# Altium project AMC_FMC_Carrier v4.PrjPcb (part 14 of 17)

## Sheet 8V54816A_SUPPLY.SchDoc: AMC FMC Carrier v4
size 420 x 297 mm; CompanyName: WUT; Organization: WUT ISE; Address1: Warsaw University of Technology; Address2: Nowowiejska 15/19 00-665 Warsaw; Address3: t.przywozki@gmail.com; Revision: 1; SheetNumber: 24; SheetTotal: 29; Project: AMC FMC Carrier v4.0.2; ModifiedBy: F. Świtakowski; CheckedDate: -; Title2: 8V54816A Supply; DivGrp: ISE; Designer: T. Przywozki; ModifiedDate: -; ProjectName: ADC/DAC MEZZANINE
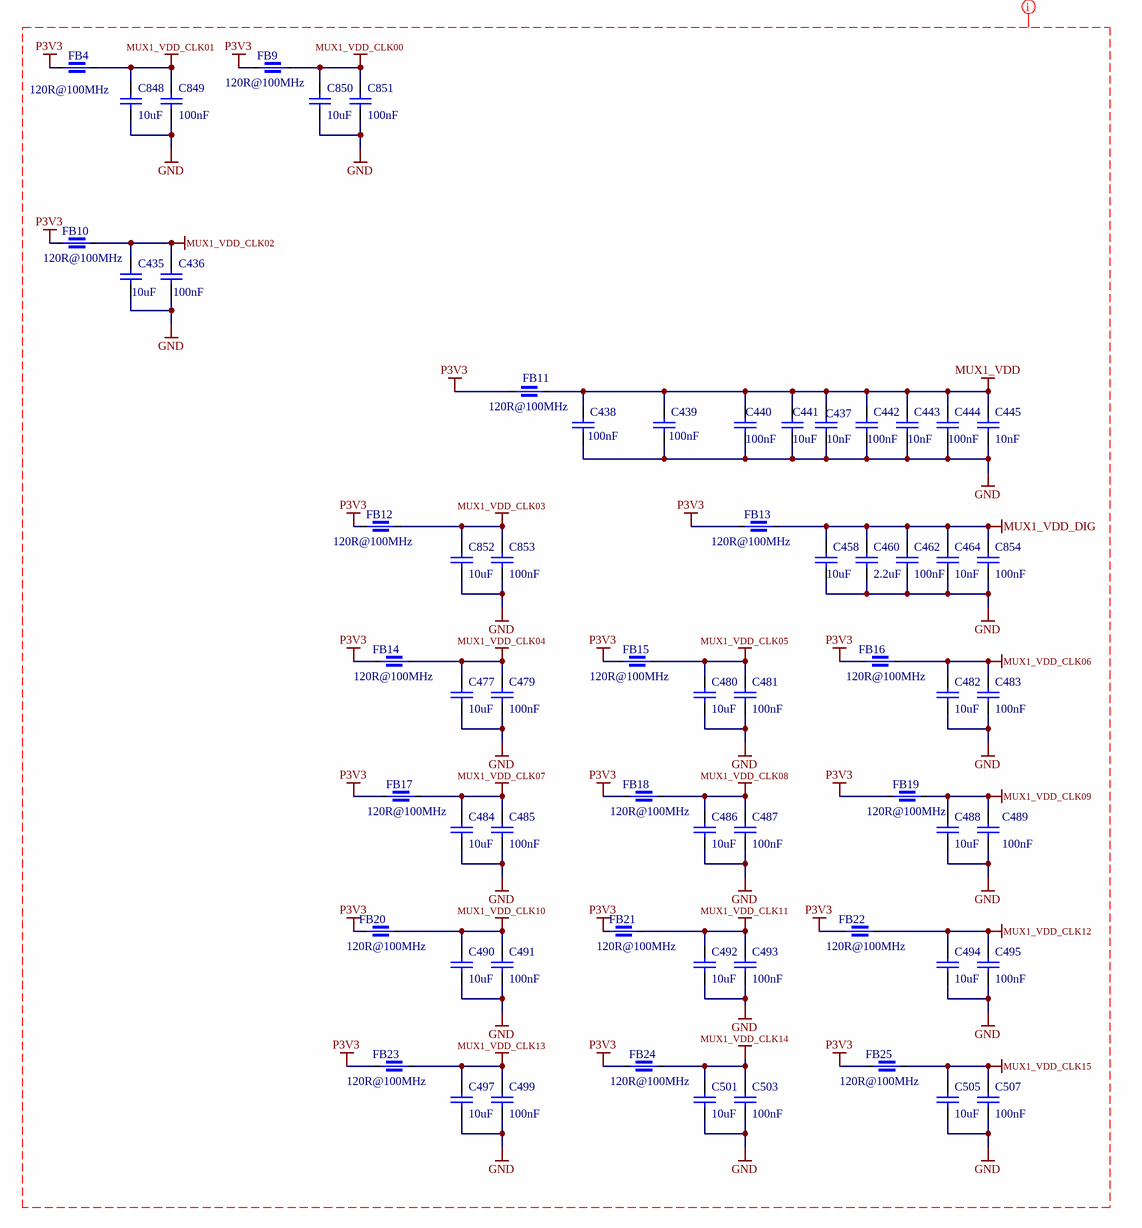
[diagram p25: 8V54816A_SUPPLY.SchDoc]

### Parts
C435  10uF  [CAPC1608X87N]
C436  100nF  [CAPC0603X33N]
C437  10nF  [CAPC0603X33N]
C438  100nF  [CAPC0603X33N]
C439  100nF  [CAPC0603X33N]
C440  100nF  [CAPC0603X33N]
C441  10uF  [CAPC1608X87N]
C442  100nF  [CAPC0603X33N]
C443  10nF  [CAPC0603X33N]
C444  100nF  [CAPC0603X33N]
C445  10nF  [CAPC0603X33N]
C458  10uF  [CAPC1608X87N]
C460  2.2uF  [CAPC1005X55N]
C462  100nF  [CAPC0603X33N]
C464  10nF  [CAPC0603X33N]
C477  10uF  [CAPC1608X87N]
C479  100nF  [CAPC0603X33N]
C480  10uF  [CAPC1608X87N]
C481  100nF  [CAPC0603X33N]
C482  10uF  [CAPC1608X87N]
C483  100nF  [CAPC0603X33N]
C484  10uF  [CAPC1608X87N]
C485  100nF  [CAPC0603X33N]
C486  10uF  [CAPC1608X87N]
C487  100nF  [CAPC0603X33N]
C488  10uF  [CAPC1608X87N]
C489  100nF  [CAPC0603X33N]
C490  10uF  [CAPC1608X87N]
C491  100nF  [CAPC0603X33N]
C492  10uF  [CAPC1608X87N]
C493  100nF  [CAPC0603X33N]
C494  10uF  [CAPC1608X87N]
C495  100nF  [CAPC0603X33N]
C497  10uF  [CAPC1608X87N]
C499  100nF  [CAPC0603X33N]
C501  10uF  [CAPC1608X87N]
C503  100nF  [CAPC0603X33N]
C505  10uF  [CAPC1608X87N]
C507  100nF  [CAPC0603X33N]
C848  10uF  [CAPC1608X87N]
C849  100nF  [CAPC0603X33N]
C850  10uF  [CAPC1608X87N]
C851  100nF  [CAPC0603X33N]
C852  10uF  [CAPC1608X87N]
C853  100nF  [CAPC0603X33N]
C854  100nF  [CAPC0603X33N]
FB4  120R@100MHz  [INDC1005X55N]
FB9  120R@100MHz  [INDC1005X55N]
FB10  120R@100MHz  [INDC1005X55N]
FB11  120R@100MHz  [INDC1005X55N]
FB12  120R@100MHz  [INDC1005X55N]
FB13  120R@100MHz  [INDC1005X55N]
FB14  120R@100MHz  [INDC1005X55N]
FB15  120R@100MHz  [INDC1005X55N]
FB16  120R@100MHz  [INDC1005X55N]
FB17  120R@100MHz  [INDC1005X55N]
FB18  120R@100MHz  [INDC1005X55N]
FB19  120R@100MHz  [INDC1005X55N]
FB20  120R@100MHz  [INDC1005X55N]
FB21  120R@100MHz  [INDC1005X55N]
FB22  120R@100MHz  [INDC1005X55N]
FB23  120R@100MHz  [INDC1005X55N]
FB24  120R@100MHz  [INDC1005X55N]
FB25  120R@100MHz  [INDC1005X55N]

### Nets
GND: C435.1 C436.1 C437.1 C438.1 C439.1 C440.1 C441.1 C442.1 C443.1 C444.1 C445.1 C458.1 C460.1 C462.1 C464.1 C477.1 C479.1 C480.1 C481.1 C482.1 C483.1 C484.1 C485.1 C486.1 C487.1 C488.1 C489.1 C490.1 C491.1 C492.1 C493.1 C494.1 C495.1 C497.1 C499.1 C501.1 C503.1 C505.1 C507.1 C848.1 C849.1 C850.1 C851.1 C852.1 C853.1 C854.1
MUX1_VDD: C437.2 C438.2 C439.2 C440.2 C441.2 C442.2 C443.2 C444.2 C445.2 FB11.1
MUX1_VDD_CLK00: C850.2 C851.2 FB9.1
MUX1_VDD_CLK01: C848.2 C849.2 FB4.1
MUX1_VDD_CLK02: C435.2 C436.2 FB10.1
MUX1_VDD_CLK03: C852.2 C853.2 FB12.1
MUX1_VDD_CLK04: C477.2 C479.2 FB14.1
MUX1_VDD_CLK05: C480.2 C481.2 FB15.1
MUX1_VDD_CLK06: C482.2 C483.2 FB16.1
MUX1_VDD_CLK07: C484.2 C485.2 FB17.1
MUX1_VDD_CLK08: C486.2 C487.2 FB18.1
MUX1_VDD_CLK09: C488.2 C489.2 FB19.1
MUX1_VDD_CLK10: C490.2 C491.2 FB20.1
MUX1_VDD_CLK11: C492.2 C493.2 FB21.1
MUX1_VDD_CLK12: C494.2 C495.2 FB22.1
MUX1_VDD_CLK13: C497.2 C499.2 FB23.1
MUX1_VDD_CLK14: C501.2 C503.2 FB24.1
MUX1_VDD_CLK15: C505.2 C507.2 FB25.1
MUX1_VDD_DIG: C458.2 C460.2 C462.2 C464.2 C854.2 FB13.1
P3V3: FB4.2 FB9.2 FB10.2 FB11.2 FB12.2 FB13.2 FB14.2 FB15.2 FB16.2 FB17.2 FB18.2 FB19.2 FB20.2 FB21.2 FB22.2 FB23.2 FB24.2 FB25.2

### Layout directives
net class POWER: GND, MUX1_VDD, MUX1_VDD_CLK00, MUX1_VDD_CLK01, MUX1_VDD_CLK02, MUX1_VDD_CLK03, MUX1_VDD_CLK04, MUX1_VDD_CLK05, MUX1_VDD_CLK06, MUX1_VDD_CLK07, MUX1_VDD_CLK08, MUX1_VDD_CLK09, MUX1_VDD_CLK10, MUX1_VDD_CLK11, MUX1_VDD_CLK12, MUX1_VDD_CLK13, MUX1_VDD_CLK14, MUX1_VDD_CLK15, MUX1_VDD_DIG, P3V3

### Notes on the sheet
- Project/Equipment
- Document
- Designer
- Drawn by
- Check.by
- Copyright CNPEM 2013, WUT ISE 2020
  This documentation describes Open Hardware and is licensed under CERN OHL v.1.1. You may redistribute and modify this documentaction under the terms of the CERN OHL v1.1.
  (http://ohwr.org/CERNOHL). This documentation is dristributed WITHOUT ANY EXPRESS OR IMPLIED WARRANTY, INCLUDING OF MERCHANTABLITY, SATISFACTORY QUALITY AND FITNESS FOR A PARTICULAR PURPOSE. Please see the CERN OHL v.1.1 for applicable conditions
- File
- Last Mod.
- Print Date
- Sheet
- Size
- A3
- of
- Rev
- Contact:

### Library data of the parts
C435 C441 C458 C477 C480 C482 C484 C486 C488 C490 C492 C494 C497 C501 C505 C848 C850 C852 = CC0603_10uF_6.3V_20%_X5R: Non-polarised capacitor; Manufacturer: GENERIC; Part Description: SMD Multilayer Chip Ceramic Capacitor; Manufacturer1 Part Number: C0603C106M9PAC; Tolerance: ±20%; Voltage: 6.3V; TC: X5R; Manufacturer Part Number: CC0603_10uF_6.3V_20%_X5R; Part Number: CC0603_10UF_6.3V_20%_X5R; Value: 10uF; Component Kind: Standard; Component Type: Standard; Pin Count: 2; Status: Preferred; Case: 0603; Mounted: Yes; Socket: No; SMD: Yes; Sense: No; Manufacturer1 Example: KEMET; Manufacturer1 ComponentHeight: 0.95mm; HelpURL: \\cern.ch\dfs\Applications\Altium\Datasheets\CC0603_X5R_KEMET.pdf; Author: CERN DEM JLC; CreateDate: 03/12/2007; LatestRevisionDate: 03/12/2007
C436 C438-C440 C442 C444 C462 C479 C481 C483 C485 C487 C489 C491 C493 C495 C499 C503 C507 C849 C851 C853 C854 = CC0201_100NF_6.3V_10%_X5R: as C418 on sheet Oscillators; Manufacturer Part Number: CC0201_100NF_6.3V_10%_X5R; Part Number: CC0201_100NF_6.3V_10%_X5R; Value: 100nF; Component Kind: Standard; Component Type: Standard; Pin Count: 2; Status: Not Recommended; Case: 0201; Mounted: Yes; Socket: No; SMD: Yes; Sense: No; Manufacturer1 Example: AVX; Manufacturer1 ComponentHeight: 0.33mm; HelpURL: \\cern.ch\dfs\Applications\Altium\Datasheets\CC0201_X5R_AVX.pdf; Author: CERN DEM JLC; CreateDate: 03/12/2007; LatestRevisionDate: 03/12/2007
C437 C443 C445 C464 = CC0201_10NF_10V_10%_X5R: Non-polarised capacitor; Manufacturer: GENERIC; Manufacturer1 Part Number: 0201ZD103KAT2A; Part Description: SMD Multilayer Chip Ceramic Capacitor; TC: X5R; Tolerance: ±10%; Voltage: 10V; Author: CERN DEM JLC; Case: 0201; Component Kind: Standard; Component Type: Standard; CreateDate: 03/12/2007; HelpURL: \\cern.ch\dfs\Applications\Altium\Datasheets\CC0201_X5R_AVX.pdf; LatestRevisionDate: 03/12/2007; Manufacturer Part Number: CC0201_10NF_10V_10%_X5R; Manufacturer1 ComponentHeight: 0.33mm; Manufacturer1 Example: AVX; Mounted: Yes; Part Number: CC0201_10NF_10V_10%_X5R; Pin Count: 2; SMD: Yes; Socket: No; Status: Not Recommended; Value: 10nF; Sense: No
C460 = CC0402_2.2UF_6.3V_10%_X5R: Non-polarised capacitor; Manufacturer: GENERIC; Part Description: SMD Multilayer Chip Ceramic Capacitor; Manufacturer1 Part Number: C1005X5R0J225K050BC; Tolerance: ±10%; Voltage: 6.3V; TC: X5R; Manufacturer Part Number: CC0402_2.2UF_6.3V_10%_X5R; Part Number: CC0402_2.2UF_6.3V_10%_X5R; Value: 2.2uF; Component Kind: Standard; Component Type: Standard; Pin Count: 2; Status: Preferred; Case: 0402; Mounted: Yes; Socket: No; SMD: Yes; Sense: No; Manufacturer1 Example: TDK; Manufacturer1 ComponentHeight: 0.55mm; HelpURL: \\cern.ch\dfs\Applications\Altium\Datasheets\CC0402_X5R_TDK_C.pdf; Author: CERN DEM JMW; CreateDate: 22/09/2015; LatestRevisionDate: 22/09/2015
FB4 FB9-FB25 = IND0402_MURATA_BLM15PX121SN1D: Manufacturer: MURATA; Part Description: SMD EMIFIL Chip Ferrite Bead; Power: 2A; Resistance: 0.055R; Tolerance: ±25%; Author: CERN DEM JMW; Case: 0402; Component Kind: Standard; Component Type: Standard; ComponentHeight: 0.55mm; CreateDate: 19/02/2014; HelpURL: \\cern.ch\dfs\Applications\Altium\Datasheets\IND0402_MURATA_BLM15PX.pdf; LatestRevisionDate: 25/10/2018; Manufacturer Part Number: BLM15PX121SN1D; Mounted: Yes; Part Number: IND0402_MURATA_BLM15PX121SN1D; Pin Count: 2; SMD: Yes; Socket: No; Status: None; Value: 120R@100MHz; Sense: No

## Sheet USB_SERIAL_QUAD.SchDoc: AMC FMC Carrier v4.0.5
size 420 x 297 mm; CmpIndex: 15; Drawing Project: AMC FMC Carrier Board; SymIndex: 2141; CompanyName: WUT; Organization: WUT ISE; Address1: Warsaw University of Technology; Address2: Nowowiejska 15/19 00-665 Warsaw; Address3: t.przywozki@gmail.com; Revision: 1; SheetNumber: 28; SheetTotal: 29; Project: AMC FMC Carrier v4.0.5; ModifiedBy: F. Świtakowski; CheckedDate: -; Title2: Quad USB - serial; DivGrp: ISE; Designer: T. Przywozki; ModifiedDate: -; ProjectName: ADC/DAC MEZZANINE
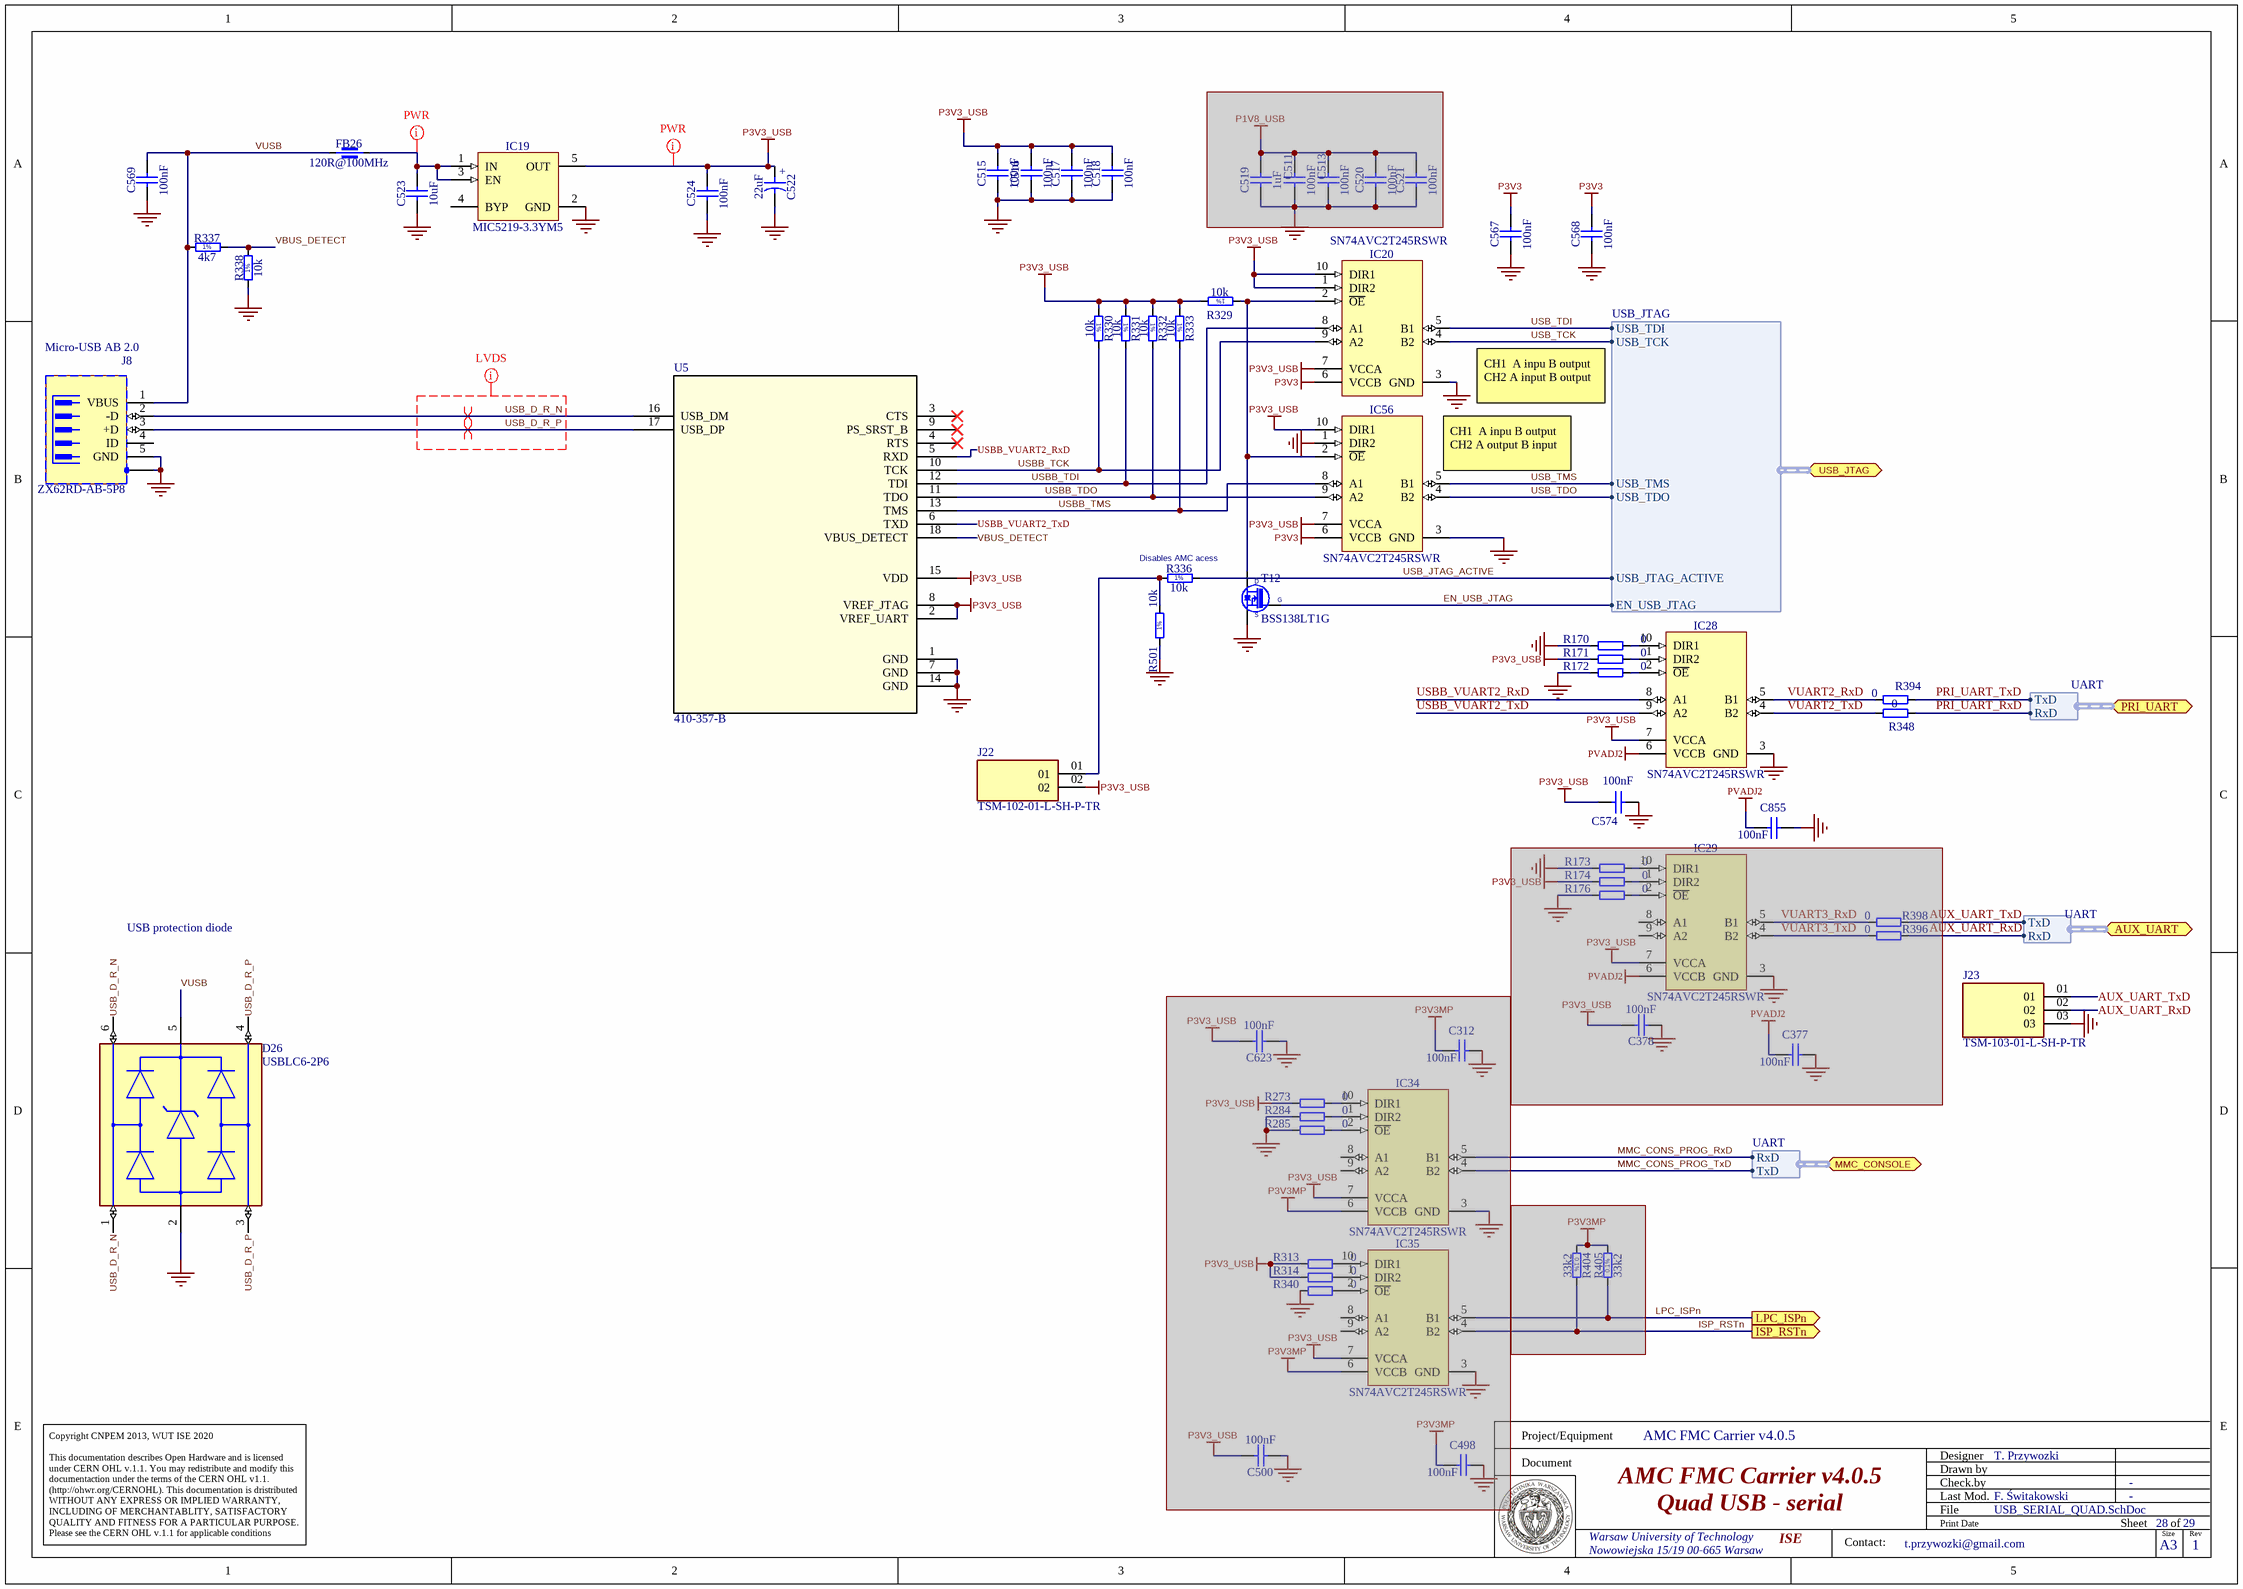
[diagram p26: USB_SERIAL_QUAD.SchDoc]

### Parts
C312  100nF  [CAPC0603X33N]  (masked out: inside a compile mask, not in the netlist)
C377  100nF  [CAPC0603X33N]  (masked out: inside a compile mask, not in the netlist)
C378  100nF  [CAPC0603X33N]  (masked out: inside a compile mask, not in the netlist)
C498  100nF  [CAPC0603X33N]  (masked out: inside a compile mask, not in the netlist)
C500  100nF  [CAPC0603X33N]  (masked out: inside a compile mask, not in the netlist)
C511  100nF  [CAPC0603X33N]  (masked out: inside a compile mask, not in the netlist)
C513  100nF  [CAPC0603X33N]  (masked out: inside a compile mask, not in the netlist)
C515  100nF  [CAPC0603X33N]
C516  100nF  [CAPC0603X33N]
C517  100nF  [CAPC0603X33N]
C518  100nF  [CAPC0603X33N]
C519  1uF  [CAPC1005X55N]  (masked out: inside a compile mask, not in the netlist)
C520  100nF  [CAPC0603X33N]  (masked out: inside a compile mask, not in the netlist)
C521  100nF  [CAPC0603X33N]  (masked out: inside a compile mask, not in the netlist)
C522  22uF  [CAPMP3216X180N]
C523  10uF  [CAPC1608X87N]
C524  100nF  [CAPC0603X33N]
C567  100nF  [CAPC0603X33N]
C568  100nF  [CAPC0603X33N]
C569  100nF  [CAPC0603X33N]
C574  100nF  [CAPC0603X33N]
C623  100nF  [CAPC0603X33N]  (masked out: inside a compile mask, not in the netlist)
C855  100nF  [CAPC0603X33N]
D26  USBLC6-2P6  [FP-SOT-666-MFG]
FB26  120R@100MHz  [INDC1608X65N]
IC19  MIC5219-3.3YM5  [SOT95P280X145-5N]
IC20  SN74AVC2T245RSWR  [QFN40P140X180X55-10N]
IC28  SN74AVC2T245RSWR  [QFN40P140X180X55-10N]
IC29  SN74AVC2T245RSWR  [QFN40P140X180X55-10N]  (masked out: inside a compile mask, not in the netlist)
IC34  SN74AVC2T245RSWR  [QFN40P140X180X55-10N]  (masked out: inside a compile mask, not in the netlist)
IC35  SN74AVC2T245RSWR  [QFN40P140X180X55-10N]  (masked out: inside a compile mask, not in the netlist)
IC56  SN74AVC2T245RSWR  [QFN40P140X180X55-10N]
J8  Micro-USB AB 2.0  Manufacturer Part Number: ZX62RD-AB-5P8  [HIROSE_ZX62RD-AB-5P8]
J22  TSM-102-01-L-SH-P-TR  [SAMTEC_TSM-102-01-L-SH-P-TR]
J23  TSM-103-01-L-SH-P-TR  [SAMTEC_TSM-103-01-L-SH-P-TR]
R170  0  [RESC0603X28N]
R171  0  [RESC0603X28N]
R172  0  [RESC0603X28N]
R173  0  [RESC0603X28N]  (masked out: inside a compile mask, not in the netlist)
R174  0  [RESC0603X28N]  (masked out: inside a compile mask, not in the netlist)
R176  0  [RESC0603X28N]  (masked out: inside a compile mask, not in the netlist)
R273  0  [RESC0603X28N]  (masked out: inside a compile mask, not in the netlist)
R284  0  [RESC0603X28N]  (masked out: inside a compile mask, not in the netlist)
R285  0  [RESC0603X28N]  (masked out: inside a compile mask, not in the netlist)
R313  0  [RESC0603X28N]  (masked out: inside a compile mask, not in the netlist)
R314  0  [RESC0603X28N]  (masked out: inside a compile mask, not in the netlist)
R329  10k  [RESC1005X40N]
R330  10k  [RESC1005X40N]
R331  10k  [RESC1005X40N]
R332  10k  [RESC1005X40N]
R333  10k  [RESC1005X40N]
R336  10k  [RESC1005X40N]
R337  4k7  [RESC1005X40N]
R338  10k  [RESC1005X40N]
R340  0  [RESC0603X28N]  (masked out: inside a compile mask, not in the netlist)
R348  0  [RESC1005X40N]
R394  0  [RESC1005X40N]
R396  0  [RESC1005X40N]  (masked out: inside a compile mask, not in the netlist)
R398  0  [RESC1005X40N]  (masked out: inside a compile mask, not in the netlist)
R404  33k2  [RESC1608X55N]  (masked out: inside a compile mask, not in the netlist)
R405  33k2  [RESC1608X55N]  (masked out: inside a compile mask, not in the netlist)
R501  10k  [RESC1005X40N]
T12  BSS138LT1G  [SOT95P240X110-3N]
U5  410-357-B  [QFN18_410-357-B_DGT]

### Ports
AUX_UART (bidir, harness UART), ISP_RSTn (out), LPC_ISPn (out), MMC_CONSOLE (bidir, harness UART), PRI_UART (bidir, harness UART), USB_JTAG (bidir, harness USB_JTAG)

### Harnesses
UART: RxD, TxD
USB_JTAG: USB_TDI, USB_TCK, USB_TMS, USB_TDO, USB_JTAG_ACTIVE, EN_USB_JTAG

### Nets
GND: C515.1 C516.1 C517.1 C518.1 C522.2 C523.1 C524.1 C567.1 C568.1 C569.1 C574.1 C855.1 D26.2(GND) IC19.2(GND) IC20.3(GND) IC28.3(GND) IC56.1(DIR2) IC56.3(GND) J8.5(GND) J8.6(SH) J23.03 R170.1 R172.1 R338.1 R501.1 T12.2(S) U5.1(GND) U5.7(GND) U5.14(GND)
P3V3: C567.2 C568.2 IC20.6(VCCB) IC56.6(VCCB)
P3V3_USB: C515.2 C516.2 C517.2 C518.2 C522.1 C524.2 C574.2 IC19.5(OUT) IC20.1(DIR2) IC20.7(VCCA) IC20.10(DIR1) IC28.7(VCCA) IC56.7(VCCA) IC56.10(DIR1) J22.02 R171.1 R329.2 R330.1 R331.1 R332.1 R333.1 U5.2(VREF_UART) U5.8(VREF_JTAG) U5.15(VDD)
PVADJ2: C855.2 IC28.6(VCCB)
AUX_UART_RxD: J23.02
AUX_UART_TxD: J23.01
EN_USB_JTAG: T12.1(G) ; port USB_JTAG.EN_USB_JTAG
PRI_UART_RxD: R348.1 ; port PRI_UART.RxD  [project net PRI_UART_Rx]
PRI_UART_TxD: R394.1 ; port PRI_UART.TxD  [project net PRI_UART_Tx]
USB_D_R_N: D26.1(I/O1) D26.6(I/O1) J8.2(-D) U5.16(USB_DM)
USB_D_R_P: D26.3(I/O2) D26.4(I/O2) J8.3(+D) U5.17(USB_DP)
USB_JTAG_ACTIVE: R336.2 ; port USB_JTAG.USB_JTAG_ACTIVE
USB_TCK: IC20.4(B2) ; port USB_JTAG.USB_TCK
USB_TDI: IC20.5(B1) ; port USB_JTAG.USB_TDI
USB_TDO: IC56.4(B2) ; port USB_JTAG.USB_TDO
USB_TMS: IC56.5(B1) ; port USB_JTAG.USB_TMS
USBB_TCK: IC20.9(A2) R330.2 U5.10(TCK)
USBB_TDI: IC20.8(A1) R331.2 U5.12(TDI)
USBB_TDO: IC56.9(A2) R332.2 U5.11(TDO)
USBB_TMS: IC56.8(A1) R333.2 U5.13(TMS)
USBB_VUART2_RxD: IC28.8(A1) U5.5(RXD)
USBB_VUART2_TxD: IC28.9(A2)
VBUS_DETECT: R337.2 R338.2 U5.18(VBUS_DETECT)
VUART2_RxD: IC28.5(B1) R394.2
VUART2_TxD: IC28.4(B2) R348.2
VUSB: C569.2 D26.5(VBUS) FB26.1 J8.1(VBUS) R337.1
NetC523_2: C523.2 FB26.2 IC19.1(IN) IC19.3(EN)
NetIC20_2: IC20.2(~{OE}) IC56.2(~{OE}) R329.1 T12.3(D)
NetIC28_1: IC28.1(DIR2) R171.2
NetIC28_2: IC28.2(~{OE}) R172.2
NetIC28_10: IC28.10(DIR1) R170.2
NetJ22_01: J22.01 R336.1 R501.2

Not connected (* = marked no-connect by the designer): IC19 4(BYP); J8 4(ID); U5 3(CTS)* 4(RTS)* 6(TXD) 9(PS_SRST_B)*

### Layout directives
net class PWR: NetC523_2, P3V3_USB
differential pair: USB_D_R_N, USB_D_R_P
net class LVDS: USB_D_R_N, USB_D_R_P

### Notes on the sheet
- CH1  A inpu B output
  CH2 A input B output
- (near IC56) CH1  A inpu B output
  CH2 A output B input
- (near R336) Disables AMC acess
- USB protection diode
- Labels drawn without touching a wire or pin: USBB_VUART2_TxD
- Project/Equipment
- Document
- Designer
- Drawn by
- Check.by
- Copyright CNPEM 2013, WUT ISE 2020
  This documentation describes Open Hardware and is licensed under CERN OHL v.1.1. You may redistribute and modify this documentaction under the terms of the CERN OHL v1.1.
  (http://ohwr.org/CERNOHL). This documentation is dristributed WITHOUT ANY EXPRESS OR IMPLIED WARRANTY, INCLUDING OF MERCHANTABLITY, SATISFACTORY QUALITY AND FITNESS FOR A PARTICULAR PURPOSE. Please see the CERN OHL v.1.1 for applicable conditions
- File
- Last Mod.
- Print Date
- Sheet
- Size
- A3
- of
- Rev
- Contact:
- (in symbol CTE3216-18_22UF_6.3V_10%_LESR0900) +
- (in symbol R0402_2K2_1%_0.0625W_100PPM) 1%
- (in symbol R0402_10K_1%_0.0625W_100PPM) 1%
- (in symbol R0603_33K2_0.1%_0.063W_10PPM) 0.1%

### Library data of the parts
C312 C377 C378 C498 C500 C511 C513 C515-C518 C520 C521 C524 C567-C569 C574 C623 C855 = CC0201_100NF_6.3V_10%_X5R: as C418 on sheet Oscillators; Manufacturer Part Number: CC0201_100NF_6.3V_10%_X5R; Part Number: CC0201_100NF_6.3V_10%_X5R; Value: 100nF; Component Kind: Standard; Component Type: Standard; Pin Count: 2; Status: Not Recommended; Case: 0201; Mounted: Yes; Socket: No; SMD: Yes; Sense: No; Manufacturer1 Example: AVX; Manufacturer1 ComponentHeight: 0.33mm; HelpURL: \\cern.ch\dfs\Applications\Altium\Datasheets\CC0201_X5R_AVX.pdf; Author: CERN DEM JLC; CreateDate: 03.12.2007; LatestRevisionDate: 03.12.2007
C519 = CC0402_1UF_16V_10%_X5R: Non-polarised capacitor; Manufacturer: GENERIC; Part Description: SMD Multilayer Chip Ceramic Capacitor; Manufacturer1 Part Number: C1005X5R1C105KT; Tolerance: ±10%; Voltage: 16V; TC: X5R; Manufacturer Part Number: CC0402_1UF_16V_10%_X5R; Part Number: CC0402_1UF_16V_10%_X5R; Value: 1uF; Component Kind: Standard; Component Type: Standard; Pin Count: 2; Status: Preferred; Case: 0402; Mounted: Yes; Socket: No; SMD: Yes; Sense: No; Manufacturer1 Example: TDK; Manufacturer1 ComponentHeight: 0.55mm; HelpURL: \\cern.ch\dfs\Applications\Altium\Datasheets\CC0402_X5R_TDK_C.pdf; Author: CERN DEM JLC; CreateDate: 25.10.2012; LatestRevisionDate: 25.10.2012
C522 = CTE3216-18_22UF_6.3V_10%_LESR0900: Polarised capacitor; Manufacturer: GENERIC; Part Description: Low ESR 0R9 Solid Tantalum Chip Capacitor; Manufacturer1 Part Number: TPSA226K006R0900; Tolerance: ±10%; Voltage: 6.3V; Manufacturer Part Number: CTE3216-18_22UF_6.3V_10%_LESR0900; Part Number: CTE3216-18_22UF_6.3V_10%_LESR0900; Value: 22uF; Component Kind: Standard; Component Type: Standard; Pin Count: 2; Status: Preferred; Case: A; Mounted: Yes; Socket: No; SMD: Yes; Sense: No; Manufacturer1 Example: AVX; Manufacturer1 ComponentHeight: 1.8mm; HelpURL: \\cern.ch\dfs\Applications\Altium\Datasheets\CTE-LESR_AVX_TPS.pdf; Author: CERN DEM JLC; CreateDate: 05.05.2008; LatestRevisionDate: 20.01.2009
C523 = CC0603_10UF_6.3V_20%_X5R: Non-polarised capacitor; Manufacturer: GENERIC; Part Description: SMD Multilayer Chip Ceramic Capacitor; Manufacturer1 Part Number: C0603C106M9PAC; Tolerance: ±20%; Voltage: 6.3V; TC: X5R; Manufacturer Part Number: CC0603_10uF_6.3V_20%_X5R; Part Number: CC0603_10UF_6.3V_20%_X5R; Value: 10uF; Component Kind: Standard; Component Type: Standard; Pin Count: 2; Status: Preferred; Case: 0603; Mounted: Yes; Socket: No; SMD: Yes; Sense: No; Manufacturer1 Example: KEMET; Manufacturer1 ComponentHeight: 0.95mm; HelpURL: \\cern.ch\dfs\Applications\Altium\Datasheets\CC0603_X5R_KEMET.pdf; Author: CERN DEM JLC; CreateDate: 03.12.2007; LatestRevisionDate: 03.12.2007
D26 = CMP-12225-000058-1: TVS DIODE 5.25V 17V SOT666; Min Breakdown Voltage: 6V; Power Line Protection: Yes; Element Configuration: Dual; Test Current: 1mA; Working Voltage: 5V; Number of Channels: 2; Max Reverse Leakage Current: 150nA; Direction: Unidirectional; Peak Pulse Current: 5A; Number of Elements: 1; Capacitance: 3.5pF; Max Breakdown Voltage: 6V; Height: 0.6mm; Depth: 1.3mm; Contact Plating: Tin; Reverse Breakdown Voltage: 6V; REACH SVHC: No SVHC; Operating Supply Voltage: 5V; Width: 1.3mm; Max Operating Temperature: 125°C; Reverse Standoff Voltage: 5V; ESD Protection: Yes; Package Quantity: 1; Termination: SMD/SMT; Length: 1.7mm; Leakage Current: 150nA; Number of Bidirectional Channels: 2; Case/Package: SOT-666; Min Operating Temperature: -40°C; Number of Pins: 6; Clamping Voltage: 17V; Breakdown Voltage: 6V; Lead Free: Lead Free; Radiation Hardening: No; Packaging: Tape and Reel; Mount: Surface Mount; Polarity: Unidirectional
FB26 = IND0603_MURATA_BLM18SG121TN1D: Manufacturer: MURATA; Part Description: SMD EMIFIL Suppression Chip Ferrite Bead; Tolerance: ±25%; Power: 3A; Resistance: 0.025R; Manufacturer Part Number: BLM18SG121TN1D; Part Number: IND0603_MURATA_BLM18SG121TN1D; Value: 120R@100MHz; Component Kind: Standard; Component Type: Standard; Pin Count: 2; Status: None; Case: 0603; Mounted: Yes; Socket: No; SMD: Yes; Sense: No; ComponentHeight: 0.65mm; HelpURL: \\cern.ch\dfs\Applications\Altium\Datasheets\IND0603_MURATA_BLM18S.pdf; Author: CERN DEM JLC; CreateDate: 23.07.2014; LatestRevisionDate: 25.10.2018
IC19 = MIC5219-3.3YM5: 500mA Peak Output LDO Regulator; Part Description: 3.3V 500mA Peak Output Low Drop-Out  (LDO) Regulator; Manufacturer: MICROCHIP TECHNOLOGY; PressFit: No; Bonding: No; Part Number: MIC5219-3.3YM5; Component Kind: Standard; Component Type: Standard; Device: MIC5219-3.3YM5; PackageDescription: SOT, 0.95mm pitch; 5 pin, 1.60mm W X 2.90mm L X 1.45mm H body, IPC Medium Density; Manufacturer Part Number: MIC5219-3.3YM5; Pin Count: 5; Case: SOT23-5; Mounted: Yes; Socket: No; SMD: Yes; Sense: No; ComponentHeight: 1.45mm; HelpURL: \\cern.ch\dfs\Applications\Altium\Datasheets\MIC5219-3.3YM5.pdf; Author: CERN DEM WB; CreateDate: 16.04.2019; LatestRevisionDate: 16.04.2019
IC20 IC28 IC29 IC34 IC35 IC56 = SN74AVC2T245RSWR: Dual-Bit Dual-Supply Bus Transceiver With Configurable Voltage Translation and 3-State Outputs; Manufacturer: TEXAS INSTRUMENTS; PressFit: No; Bonding: No; Manufacturer Part Number: SN74AVC2T245RSWR; PackageDescription: QFN, 0.40mm Pitch, Rect.;10 Pin, 1.80mm L X 1.40mm W X 0.55mm H Body, IPC Medium Density; Part Description: Dual-Bit Dual-Supply Bus Transceiver With Configurable Voltage Translation and 3-State Outputs; Part Number: SN74AVC2T245RSWR; Component Kind: Standard; Component Type: Standard; Device: SN74AVC2T245RSWR; Status: Not Recommended; Pin Count: 10; Case: QFN10; Mounted: Yes; Socket: No; SMD: Yes; Sense: No; ComponentHeight: 0.55mm; Author: CERN DEM JLC; HelpURL: \\cern.ch\dfs\Applications\Altium\Datasheets\SN74AVC2T245RSWR.pdf; CreateDate: 07.07.2014; LatestRevisionDate: 30.03.2017
J8 = HIROSE_ZX62RD-AB-5P8: 5 Pin + 1 Shield USB Receptacle; Manufacturer: HIROSE (HRS); Part Description: Micro-USB 2.0 Right Angle, SMD Type AB - Reverse (Top mount), Shell Through Hole; PressFit: No; Part Number: HIROSE_ZX62RD-AB-5P8; Component Kind: Standard; Component Type: Standard; Pin Count: 7; Family: Micro-USB AB 2.0; Mounted: Yes; Socket: No; SMD: Yes; Sense: No; Status: Obsolete; ComponentHeight: 2.35mm; HelpURL: \\cern.ch\dfs\Applications\Altium\Datasheets\HIROSE_ZX62RD-AB-5P8.pdf; ComponentLink1URL: \\cern.ch\dfs\Applications\Altium\Datasheets\HIROSE_ZX62RD-AB-5P8_Package-Drawing.pdf; ComponentLink1Description: Package-Drawing; Author: CERN DEM JLC; CreateDate: 29.10.2014; LatestRevisionDate: 22.06.2017
J22 = TSM-102-01-L-SH-P-TR: MF: Samtec; Availability: Unavailable; MP: TSM-102-01-L-SH-P-TR; Price: None; Package: None; Value: *
J23 = TSM-103-01-L-SH-P-TR: MF: Samtec; Availability: Unavailable; MP: TSM-103-01-L-SH-P-TR; Package: None; Value: *; Price: None
R170-R174 R176 R273 R284 R285 R313 R314 R340 = R0201_0R_JUMPER: as R354-R357 on sheet Clock_management; Part Number: R0201_0R_JUMPER; Component Kind: Standard; Component Type: Standard; Pin Count: 2; Value: 0; Status: Not Recommended; Manufacturer Part Number: R0201_0R_JUMPER; Case: 0201; Mounted: Yes; Sense: No; Socket: No; SMD: Yes; Manufacturer1 Example: VISHAY; Manufacturer1 ComponentHeight: 0.27mm; HelpURL: \\cern.ch\dfs\Applications\Altium\Datasheets\R0201_VISHAY_CRCW e3.pdf; Author: CERN DEM JLC; CreateDate: 19.11.2014; LatestRevisionDate: 08.01.2015
R329-R333 R336 R338 R501 = R0402_10K_1%_0.0625W_100PPM: Resistor - 1%; Manufacturer: GENERIC; Part Description: General Purpose Thick Film Chip Resistor; Manufacturer1 Part Number: 232270671003L; TC: ±100ppm/°C; PressFit: No; Manufacturer Part Number: R0402_10K_1%_0.0625W_100PPM; Part Number: R0402_10K_1%_0.0625W_100PPM; Tolerance: ±1%; Value: 10k; Component Kind: Standard; Component Type: Standard; Pin Count: 2; Status: Not Recommended; Power: 0.0625W; Case: 0402; Mounted: Yes; Sense: No; Socket: No; SMD: Yes; Manufacturer1 Example: YAGEO PHYCOMP; Manufacturer1 ComponentHeight: 0.4mm; HelpURL: \\cern.ch\dfs\Applications\Altium\Datasheets\R0402_Phycomp_RC0402.pdf; Author: CERN DEM JLC; CreateDate: 03.12.2007; LatestRevisionDate: 17.10.2012
R337 = R0402_2K2_1%_0.0625W_100PPM: Resistor - 1%; Manufacturer: GENERIC; Part Description: General Purpose Thick Film Chip Resistor; Manufacturer1 Part Number: 232270672202L; TC: ±100ppm/°C; PressFit: No; Manufacturer Part Number: R0402_2K2_1%_0.0625W_100PPM; Part Number: R0402_2K2_1%_0.0625W_100PPM; Tolerance: ±1%; Value: 4k7; Component Kind: Standard; Component Type: Standard; Pin Count: 2; Status: Not Recommended; Power: 0.0625W; Case: 0402; Mounted: Yes; Sense: No; Socket: No; SMD: Yes; Manufacturer1 Example: YAGEO PHYCOMP; Manufacturer1 ComponentHeight: 0.4mm; HelpURL: \\cern.ch\dfs\Applications\Altium\Datasheets\R0402_Phycomp_RC0402.pdf; Author: CERN DEM JLC; CreateDate: 03.12.2007; LatestRevisionDate: 17.10.2012
R348 R394 R396 R398 = R0402_0R_JUMPER: Resistor; Manufacturer: GENERIC; Part Description: 1A (0.05R Max DC Resistance) Zero Ohm Jumper; Manufacturer1 Part Number: 232270591001L; PressFit: No; Manufacturer Part Number: R0402_0R_JUMPER; Part Number: R0402_0R_JUMPER; Value: 0; Component Kind: Standard; Component Type: Standard; Pin Count: 2; Status: Not Recommended; Case: 0402; Mounted: Yes; Sense: No; Socket: No; SMD: Yes; Manufacturer1 Example: YAGEO PHYCOMP; Manufacturer1 ComponentHeight: 0.4mm; HelpURL: \\cern.ch\dfs\Applications\Altium\Datasheets\R0402_Phycomp_RC0402.pdf; Author: CERN DEM JLC; CreateDate: 03.12.2007; LatestRevisionDate: 17.10.2012
R404 R405 = R0603_33K2_0.1%_0.063W_10PPM: Resistor - 0.1%; Manufacturer: GENERIC; Part Description: Thin Film Chip Resistor; Manufacturer1 Part Number: RN73C1J33K2BTDF; Power: 0.063W; TC: ±10ppm; PressFit: No; Manufacturer Part Number: R0603_33K2_0.1%_0.063W_10PPM; Part Number: R0603_33K2_0.1%_0.063W_10PPM; Tolerance: ±0.1%; Value: 33k2; Component Kind: Standard; Component Type: Standard; Pin Count: 2; Status: Not Recommended; Case: 0603; Mounted: Yes; Sense: No; Socket: No; SMD: Yes; Manufacturer1 Example: TYCO HOLSWORTHY; Manufacturer1 ComponentHeight: 0.5mm; HelpURL: \\cern.ch\dfs\Applications\Altium\Datasheets\R0603_Tyco_RN73.pdf; Author: CERN DEM JLC; CreateDate: 03.12.2007; LatestRevisionDate: 13.03.2008
T12 = BSS138LT1G: N-CHANNEL MOSFET WITH DIODE; Manufacturer: ON SEMICONDUCTOR; Part Description: 50V 200mA N-Channel Enhancement Mode Field-Effect Transistor; PressFit: No; Bonding: No; Manufacturer Part Number: BSS138LT1G; PackageDescription: SOT23 3-Leads, Pitch 0.95mm - Body 1.4x3mm, IPC Medium Density; Part Number: BSS138LT1G; Component Kind: Standard; Component Type: Standard; Device: BSS138LT1G; Pin Count: 3; Case: SOT23-3; Mounted: Yes; Socket: No; SMD: Yes; Sense: No; ComponentHeight: 1.11mm; HelpURL: \\cern.ch\dfs\Applications\Altium\Datasheets\BSS138LT1G.pdf; Author: CERN DEM JLC; CreateDate: 23.03.2009; LatestRevisionDate: 23.03.2009
U5 = 410-357-B: Description; Manufacturer_Name: Digilent; Copyright: Copyright (C) 2026 Ultra Librarian. All rights reserved.; Manufacturer_Part_Number: 410-357-B; RefDes: RefDes; Type: Type; Manufacturer: Digilent; Part Number: 410-357-B

## Sheet I2C_MUX.SchDoc: AMC FMC Carrier v4.0.2
size A4; CmpIndex: 31; Drawing Project: AMC FMC Carrier Board; SymIndex: 2141; CompanyName: WUT; Organization: WUT ISE; Address1: Warsaw University of Technology; Address2: Nowowiejska 15/19 00-665 Warsaw; Address3: t.przywozki@gmail.com; Revision: 1; SheetNumber: 29; SheetTotal: 29; Project: AMC FMC Carrier v4; ModifiedBy: F. Świtakowski; CheckedDate: -; Title2: I2C switches; DivGrp: ISE; Designer: T. Przywozki; ModifiedDate: -; ProjectName: ADC/DAC MEZZANINE
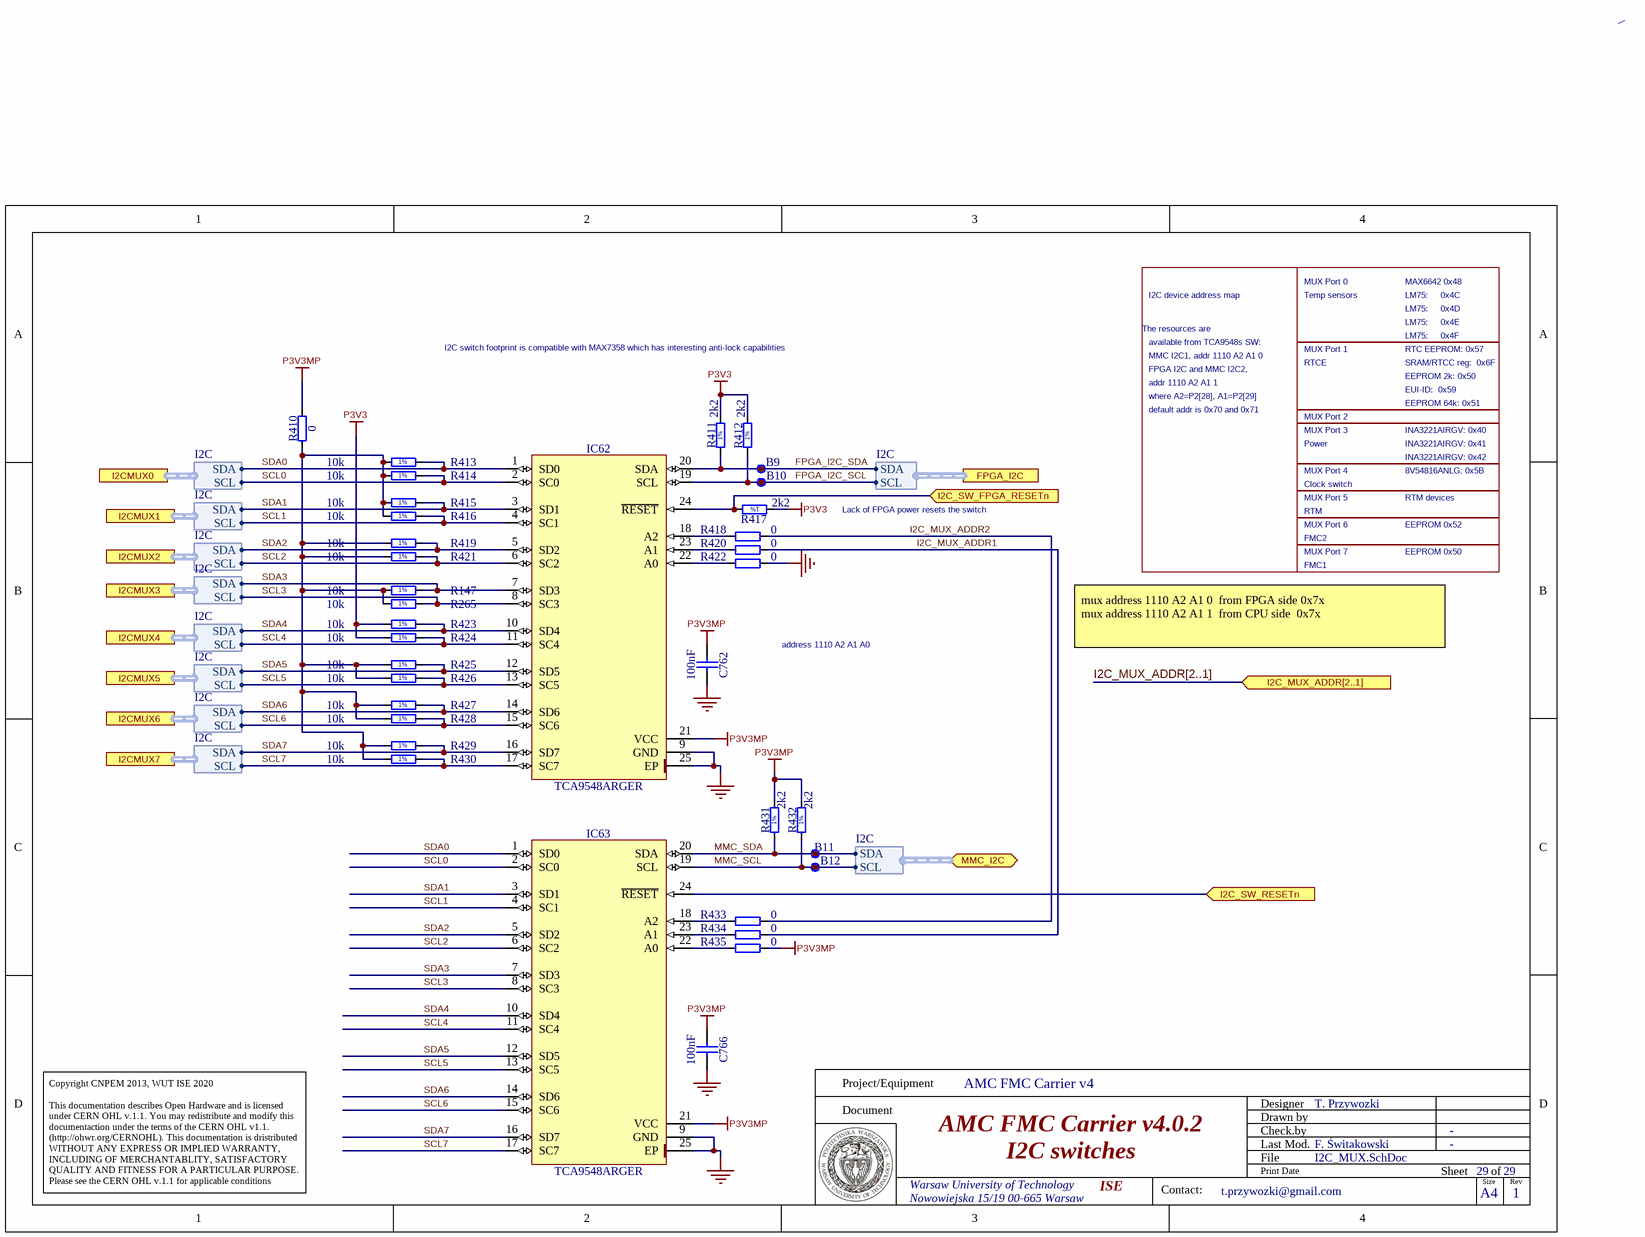
[diagram p27: I2C_MUX.SchDoc]

### Parts
B9  SMD Pad  [C100]  (value not drawn)  (no BOM)
B10  SMD Pad  [C100]  (value not drawn)  (no BOM)
B11  SMD Pad  [C100]  (value not drawn)  (no BOM)
B12  SMD Pad  [C100]  (value not drawn)  (no BOM)
C762  100nF  [CAPC0603X33N]
C766  100nF  [CAPC0603X33N]
IC62  TCA9548ARGER  [QFN50P400X400X100-25N-S220]
IC63  TCA9548ARGER  [QFN50P400X400X100-25N-S220]
R147  10k  [RESC1005X40N]
R265  10k  [RESC1005X40N]
R410  0  [RESC1005X40N]
R411  2k2  [RESC1005X40N]
R412  2k2  [RESC1005X40N]
R413  10k  [RESC1005X40N]
R414  10k  [RESC1005X40N]
R415  10k  [RESC1005X40N]
R416  10k  [RESC1005X40N]
R417  2k2  [RESC1005X40N]
R418  0  [RESC1005X40N]
R419  10k  [RESC1005X40N]
R420  0  [RESC1005X40N]
R421  10k  [RESC1005X40N]
R422  0  [RESC1005X40N]
R423  10k  [RESC1005X40N]
R424  10k  [RESC1005X40N]
R425  10k  [RESC1005X40N]
R426  10k  [RESC1005X40N]
R427  10k  [RESC1005X40N]
R428  10k  [RESC1005X40N]
R429  10k  [RESC1005X40N]
R430  10k  [RESC1005X40N]
R431  2k2  [RESC1005X40N]
R432  2k2  [RESC1005X40N]
R433  0  [RESC1005X40N]
R434  0  [RESC1005X40N]
R435  0  [RESC1005X40N]

### Ports
FPGA_I2C (harness I2C), I2C_MUX_ADDR[2..1] (in), I2C_SW_FPGA_RESETn (in), I2C_SW_RESETn (in), I2CMUX0 (harness I2C), I2CMUX1 (harness I2C), I2CMUX2 (harness I2C), I2CMUX3 (harness I2C), I2CMUX4 (harness I2C), I2CMUX5 (harness I2C), I2CMUX6 (harness I2C), I2CMUX7 (harness I2C), MMC_I2C (bidir, harness I2C)

### Harnesses
I2C: SCL, SDA

### Nets
GND: C762.2 C766.2 IC62.9(GND) IC62.25(EP) IC63.9(GND) IC63.25(EP) R422.1
P3V3: R411.2 R412.2 R417.1 R423.1 R424.1
P3V3MP: C762.1 C766.1 IC62.21(VCC) IC63.21(VCC) R410.1 R431.2 R432.2 R435.1
FPGA_I2C_RST: IC62.24(~{RESET}) R417.2 ; port I2C_SW_FPGA_RESETn
FPGA_I2C_SCL: B10.1 IC62.19(SCL) R412.1 ; port FPGA_I2C.SCL
FPGA_I2C_SDA: B9.1 IC62.20(SDA) R411.1 ; port FPGA_I2C.SDA
I2C_MUX_ADDR1: R420.1 R434.1
I2C_MUX_ADDR2: R418.1 R433.1
I2C_SW_RESETn: IC63.24(~{RESET}) ; port I2C_SW_RESETn
MMC_SCL: B12.1 IC63.19(SCL) R432.1 ; port MMC_I2C.SCL  [project net I2C_CPU.SCL]
MMC_SDA: B11.1 IC63.20(SDA) R431.1 ; port MMC_I2C.SDA  [project net I2C_CPU.SDA]
SCL0: IC62.2(SC0) IC63.2(SC0) R414.2 ; port I2CMUX0.SCL
SCL1: IC62.4(SC1) IC63.4(SC1) R416.2 ; port I2CMUX1.SCL  [project net SCL]
SCL2: IC62.6(SC2) IC63.6(SC2) R421.2 ; port I2CMUX2.SCL
SCL3: IC62.8(SC3) IC63.8(SC3) R265.2 ; port I2CMUX3.SCL  [project net PM_I2C.SCL]
SCL4: IC62.11(SC4) IC63.11(SC4) R424.2 ; port I2CMUX4.SCL  [project net CLK_I2C.SCL]
SCL5: IC62.13(SC5) IC63.13(SC5) R426.2 ; port I2CMUX5.SCL
SCL6: IC62.15(SC6) IC63.15(SC6) R428.2 ; port I2CMUX6.SCL  [project net I2C2.SCL]
SCL7: IC62.17(SC7) IC63.17(SC7) R430.2 ; port I2CMUX7.SCL  [project net I2C1.SCL]
SDA0: IC62.1(SD0) IC63.1(SD0) R413.2 ; port I2CMUX0.SDA
SDA1: IC62.3(SD1) IC63.3(SD1) R415.2 ; port I2CMUX1.SDA  [project net SDA]
SDA2: IC62.5(SD2) IC63.5(SD2) R419.2 ; port I2CMUX2.SDA
SDA3: IC62.7(SD3) IC63.7(SD3) R147.2 ; port I2CMUX3.SDA  [project net PM_I2C.SDA]
SDA4: IC62.10(SD4) IC63.10(SD4) R423.2 ; port I2CMUX4.SDA  [project net CLK_I2C.SDA]
SDA5: IC62.12(SD5) IC63.12(SD5) R425.2 ; port I2CMUX5.SDA
SDA6: IC62.14(SD6) IC63.14(SD6) R427.2 ; port I2CMUX6.SDA  [project net I2C2.SDA]
SDA7: IC62.16(SD7) IC63.16(SD7) R429.2 ; port I2CMUX7.SDA  [project net I2C1.SDA]
NetIC62_18: IC62.18(A2) R418.2
NetIC62_22: IC62.22(A0) R422.2
NetIC62_23: IC62.23(A1) R420.2
NetIC63_18: IC63.18(A2) R433.2
NetIC63_22: IC63.22(A0) R435.2
NetIC63_23: IC63.23(A1) R434.2
NetR147_1: R147.1 R265.1 R410.2 R413.1 R414.1 R415.1 R416.1 R419.1 R421.1 R425.1 R426.1 R427.1 R428.1 R429.1 R430.1

### Buses and harness runs
bus I2C_MUX_ADDR[2..1] = port I2C_MUX_ADDR[2..1]

### Notes on the sheet
- I2C device address map
- MUX Port 0
- Temp sensors
- MAX6642 0x48
- LM75:     0x4D
- LM75:     0x4C
- I2C switch footprint is compatible with MAX7358 which has interesting anti-lock capabilities
- The resources are
- FPGA I2C and MMC I2C2,
- available from TCA9548s SW:
- MMC I2C1, addr 1110 A2 A1 0
- MUX Port 1
- RTCE
- LM75:     0x4E
- LM75:     0x4F
- EEPROM 2k: 0x50
- SRAM/RTCC reg:  0x6F
- RTC EEPROM: 0x57
- addr 1110 A2 A1 1
- where A2=P2[28], A1=P2[29]
- default addr is 0x70 and 0x71
- MUX Port 3
- Power
- MUX Port 2
- EUI-ID:  0x59
- INA3221AIRGV: 0x41
- INA3221AIRGV: 0x40
- EEPROM 64k: 0x51
- Lack of FPGA power resets the switch
- MUX Port 4
- Clock switch
- MUX Port 5
- RTM
- INA3221AIRGV: 0x42
- 8V54816ANLG: 0x5B
- RTM devices
- MUX Port 7
- FMC1
- MUX Port 6
- FMC2
- EEPROM 0x50
- EEPROM 0x52
- address 1110 A2 A1 A0
- mux address 1110 A2 A1 0  from FPGA side 0x7x
  mux address 1110 A2 A1 1  from CPU side  0x7x
- Project/Equipment
- Document
- Designer
- Drawn by
- Check.by
- Copyright CNPEM 2013, WUT ISE 2020
  This documentation describes Open Hardware and is licensed under CERN OHL v.1.1. You may redistribute and modify this documentaction under the terms of the CERN OHL v1.1.
  (http://ohwr.org/CERNOHL). This documentation is dristributed WITHOUT ANY EXPRESS OR IMPLIED WARRANTY, INCLUDING OF MERCHANTABLITY, SATISFACTORY QUALITY AND FITNESS FOR A PARTICULAR PURPOSE. Please see the CERN OHL v.1.1 for applicable conditions
- File
- Last Mod.
- Print Date
- Sheet
- Size
- A4
- of
- Rev
- Contact:
- (in symbol R0402_2K2_1%_0.0625W_100PPM) 1%
- (in symbol R0402_10k_1%_0.0625W_100PPM) 1%

### Library data of the parts
B9-B12 = SMD_PAD_D1MM: Through Hole Pad; Part Description: 1mm Diameter SMD Pad; Mounted: No; Part Number: SMD_PAD_D1MM; Component Type: Standard (No BOM); Pin Count: 1; Family: SMD Pad; Socket: No; SMD: No; Sense: No; Status: None; ComponentHeight: 0mm; HelpURL: Undefined; Author: CERN DEM JLC; CreateDate: 10.10.2017; LatestRevisionDate: 10.10.2017; PackageDescription: 1mm Diameter SMD Pad
C762 C766 = CC0201_100NF_6.3V_10%_X5R: as C418 on sheet Oscillators; Manufacturer Part Number: CC0201_100NF_6.3V_10%_X5R; Part Number: CC0201_100NF_6.3V_10%_X5R; Value: 100nF; Component Kind: Standard; Component Type: Standard; Pin Count: 2; Status: Not Recommended; Case: 0201; Mounted: Yes; Socket: No; SMD: Yes; Sense: No; Manufacturer1 Example: AVX; Manufacturer1 ComponentHeight: 0.33mm; HelpURL: \\cern.ch\dfs\Applications\Altium\Datasheets\CC0201_X5R_AVX.pdf; Author: CERN DEM JLC; CreateDate: 03.12.2007; LatestRevisionDate: 03.12.2007
IC62 IC63 = TCA9548ARGER: Low Voltage 8-Channel I2C Switch With Reset; Manufacturer: TEXAS INSTRUMENTS; PressFit: No; Bonding: No; Manufacturer Part Number: TCA9548ARGER; PackageDescription: QFN, 0.50mm Pitch, Square; 24 Pin, 4.00mm L X 4.00mm W X 1.00mm H body (w/thermal tab 2.2 X 2.2mm), IPC Medium Density; Part Description: Low Voltage 8-Channel I2C Switch With Reset; Part Number: TCA9548ARGER; Component Kind: Standard; Component Type: Standard; Device: TCA9548ARGER; Pin Count: 25; Case: QFN24; Mounted: Yes; Socket: No; SMD: Yes; Sense: No; ComponentHeight: 1mm; Author: CERN DEM JLC; HelpURL: \\cern.ch\dfs\Applications\Altium\Datasheets\TCA9548ARGER.pdf; CreateDate: 07.07.2014; LatestRevisionDate: 07.07.2014
R147 R265 R413-R416 R419 R421 R423-R430 = R0402_10k_1%_0.0625W_100PPM: Resistor - 1%; Manufacturer: GENERIC; Part Description: General Purpose Thick Film Chip Resistor; Manufacturer1 Part Number: 232270671003L; TC: ±100ppm/°C; PressFit: No; Manufacturer Part Number: R0402_10K_1%_0.0625W_100PPM; Part Number: R0402_10K_1%_0.0625W_100PPM; Tolerance: ±1%; Value: 10k; Component Kind: Standard; Component Type: Standard; Pin Count: 2; Status: Not Recommended; Power: 0.0625W; Case: 0402; Mounted: Yes; Sense: No; Socket: No; SMD: Yes; Manufacturer1 Example: YAGEO PHYCOMP; Manufacturer1 ComponentHeight: 0.4mm; HelpURL: \\cern.ch\dfs\Applications\Altium\Datasheets\R0402_Phycomp_RC0402.pdf; Author: CERN DEM JLC; CreateDate: 03.12.2007; LatestRevisionDate: 17.10.2012
R410 R418 R420 R422 R433-R435 = R0402_0R_JUMPER: as R348 on sheet USB_SERIAL_QUAD; Manufacturer Part Number: R0402_0R_JUMPER; Part Number: R0402_0R_JUMPER; Value: 0; Component Kind: Standard; Component Type: Standard; Pin Count: 2; Status: Not Recommended; Case: 0402; Mounted: Yes; Sense: No; Socket: No; SMD: Yes; Manufacturer1 Example: YAGEO PHYCOMP; Manufacturer1 ComponentHeight: 0.4mm; HelpURL: \\cern.ch\dfs\Applications\Altium\Datasheets\R0402_Phycomp_RC0402.pdf; Author: CERN DEM JLC; CreateDate: 03.12.2007; LatestRevisionDate: 17.10.2012
R411 R412 R417 R431 R432 = R0402_2K2_1%_0.0625W_100PPM: as R337 on sheet USB_SERIAL_QUAD; Manufacturer Part Number: R0402_2K2_1%_0.0625W_100PPM; Part Number: R0402_2K2_1%_0.0625W_100PPM; Tolerance: ±1%; Value: 2k2; Component Kind: Standard; Component Type: Standard; Pin Count: 2; Status: Not Recommended; Power: 0.0625W; Case: 0402; Mounted: Yes; Sense: No; Socket: No; SMD: Yes; Manufacturer1 Example: YAGEO PHYCOMP; Manufacturer1 ComponentHeight: 0.4mm; HelpURL: \\cern.ch\dfs\Applications\Altium\Datasheets\R0402_Phycomp_RC0402.pdf; Author: CERN DEM JLC; CreateDate: 03.12.2007; LatestRevisionDate: 17.10.2012

## Sheet Thermometers.SchDoc: AMC FMC Carrier v4
size A4; CompanyName: WUT; Organization: WUT ISE; Address1: Warsaw University of Technology; Address2: Nowowiejska 15/19 00-665 Warsaw; Address3: t.przywozki@gmail.com; Revision: 1; SheetNumber: 19; SheetTotal: 29; Project: AMC FMC Carrier v4.0.2; ModifiedBy: F. Świtakowski; CreateDate: XX/XX/XXXX; CheckedDate: -; Title2: Thermometers; DivGrp: ISE; Designer: T. Przywozki; ModifiedDate: -; ProjectName: ADC/DAC MEZZANINE
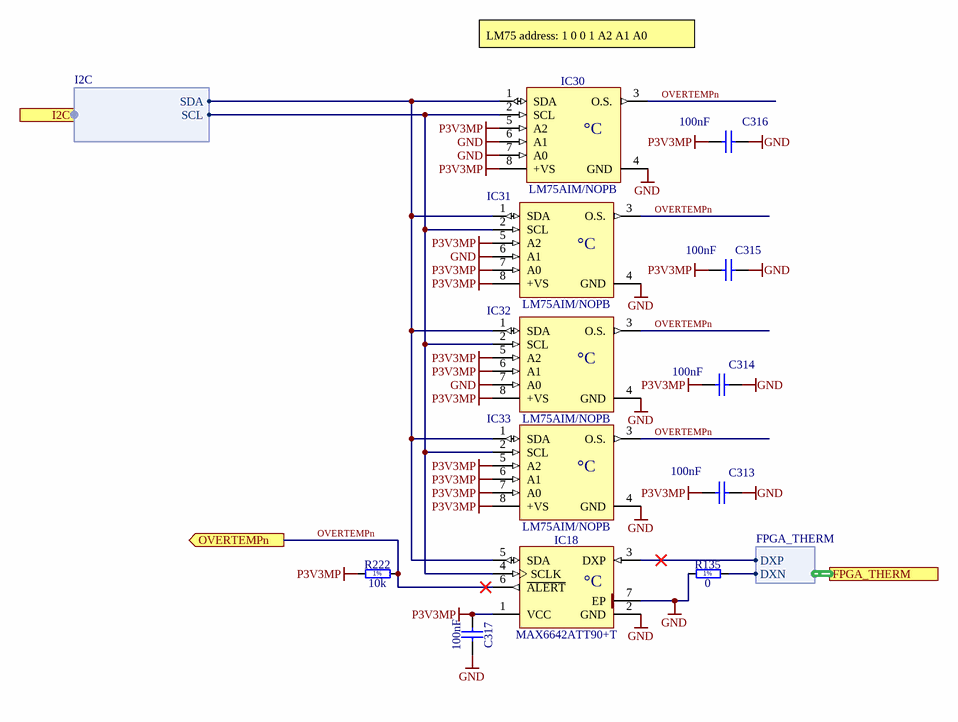
[diagram p28: Thermometers.SchDoc]

### Parts
C313  100nF  [CAPC0603X33N]
C314  100nF  [CAPC0603X33N]
C315  100nF  [CAPC0603X33N]
C316  100nF  [CAPC0603X33N]
C317  100nF  [CAPC0603X33N]
IC18  MAX6642ATT90+T  [SON95P300X300X80-7N-R160X240]
IC30  LM75AIM/NOPB  [SOIC127P600X175-8N]
IC31  LM75AIM/NOPB  [SOIC127P600X175-8N]
IC32  LM75AIM/NOPB  [SOIC127P600X175-8N]
IC33  LM75AIM/NOPB  [SOIC127P600X175-8N]
R135  0  [RESC1005X40N]
R222  10k  [RESC1005X40N]

### Ports
FPGA_THERM (harness FPGA_THERM), I2C (harness I2C), OVERTEMPn (out)

### Harnesses
FPGA_THERM: DXN, DXP
I2C: SCL, SDA

### Nets
GND: C313.2 C314.2 C315.2 C316.2 C317.2 IC18.2(GND) IC18.7(EP) IC30.4(GND) IC30.6(A1) IC30.7(A0) IC31.4(GND) IC31.6(A1) IC32.4(GND) IC32.7(A0) IC33.4(GND) R135.2
P3V3MP: C313.1 C314.1 C315.1 C316.1 C317.1 IC18.1(VCC) IC30.5(A2) IC30.8(+VS) IC31.5(A2) IC31.7(A0) IC31.8(+VS) IC32.5(A2) IC32.6(A1) IC32.8(+VS) IC33.5(A2) IC33.6(A1) IC33.7(A0) IC33.8(+VS) R222.1
OVERTEMPn: IC18.6(~{ALERT}) IC30.3(O.S.) IC31.3(O.S.) IC32.3(O.S.) IC33.3(O.S.) R222.2 ; port OVERTEMPn
SCL0: IC18.4(SCLK) IC30.2(SCL) IC31.2(SCL) IC32.2(SCL) IC33.2(SCL) ; port I2C.SCL
SDA0: IC18.5(SDA) IC30.1(SDA) IC31.1(SDA) IC32.1(SDA) IC33.1(SDA) ; port I2C.SDA
NetIC2_W17: R135.1 ; port FPGA_THERM.DXN
NetIC2_W18: IC18.3(DXP) ; port FPGA_THERM.DXP

### Notes on the sheet
- LM75 address: 1 0 0 1 A2 A1 A0
- Project/Equipment
- Document
- Designer
- Drawn by
- Check.by
- Copyright CNPEM 2013, WUT ISE 2020
  This documentation describes Open Hardware and is licensed under CERN OHL v.1.1. You may redistribute and modify this documentaction under the terms of the CERN OHL v1.1.
  (http://ohwr.org/CERNOHL). This documentation is dristributed WITHOUT ANY EXPRESS OR IMPLIED WARRANTY, INCLUDING OF MERCHANTABLITY, SATISFACTORY QUALITY AND FITNESS FOR A PARTICULAR PURPOSE. Please see the CERN OHL v.1.1 for applicable conditions
- File
- Last Mod.
- Print Date
- Sheet
- Size
- A4
- of
- Rev
- Contact:
- (in symbol LM75AIM/NOPB) °C
- (in symbol MAX6642ATT90+T) °C
- (in symbol R0402_0R_JUMPER) 1%
- (in symbol R0402_10K_1%_0.0625W_100PPM) 1%

### Library data of the parts
C313-C317 = CC0201_100NF_6.3V_10%_X5R: as C212 on sheet Clock_management; Part Number: CC0201_100NF_6.3V_10%_X5R; Component Kind: Standard; Component Type: Standard; Pin Count: 2; Value: 100nF; Status: Not Recommended; Manufacturer Part Number: CC0201_100NF_6.3V_10%_X5R; Case: 0201; Mounted: Yes; Socket: No; SMD: Yes; Manufacturer1 Example: AVX; Manufacturer1 ComponentHeight: 0.33mm; HelpURL: \\cern.ch\dfs\Applications\Altium\Datasheets\CC0201_X5R_AVX.pdf; Author: CERN DEM JLC; CreateDate: 2007-12-03; LatestRevisionDate: 2007-12-03
IC18 = MAX6642ATT90+T: ±1°C, SMBus-Compatible Remote/Local Temperature Sensor with Overtemperature Alarm; Part Description: 0°C to +125°C, ±1°C, SMBus-Compatible Remote/Local Temperature Sensor with Overtemperature Alarm (Address 1001 000); Manufacturer: MAXIM; PressFit: No; Bonding: No; Part Number: MAX6642ATT90+T; Component Kind: Standard; Component Type: Standard; Device: MAX6642ATT90+T; PackageDescription: SON, 0.95mm Pitch; 6 Pin, 3.00mm W X 3mm L X 0.80mm H body (w/Thermal Tab 1.6mm x 2.4mm); Manufacturer Part Number: MAX6642ATT90+T; Pin Count: 7; Case: SON6; Mounted: Yes; Socket: No; SMD: Yes; Sense: No; ComponentHeight: 0.8mm; HelpURL: \\cern.ch\dfs\Applications\Altium\Datasheets\MAX6642ATT90+T.pdf; Author: CERN DEM JLC; CreateDate: 26.11.2013; LatestRevisionDate: 26.11.2013
IC30-IC33 = LM75AIM/NOPB: Digital Temperature Sensor and Thermal Watchdog with Two-Wire Interface; Part Description: -25° to +100°C ±2°C Digital Temperature Sensor and Thermal Watchdog with Two-Wire Interface; Manufacturer: TEXAS INSTRUMENTS; PressFit: No; Bonding: No; Part Number: LM75AIM/NOPB; Component Kind: Standard; Component Type: Standard; Device: LM75AIM/NOPB; PackageDescription: SOIC 8, Pitch 1.27mm - Body 4x5mm, IPC Medium Density; Manufacturer Part Number: LM75AIM/NOPB; Pin Count: 8; Case: SOIC8; Mounted: Yes; Socket: No; SMD: Yes; Sense: No; ComponentHeight: 1.75mm; HelpURL: \\cern.ch\dfs\Applications\Altium\Datasheets\LM75AIM-NOPB.pdf; Author: CERN DEM JLC; CreateDate: 15.10.2012; LatestRevisionDate: 15.10.2012
R135 = R0402_0R_JUMPER: Resistor - 1%; Part Description: 1A (0.05R Max DC Resistance) Zero Ohm Jumper; Manufacturer: GENERIC; Manufacturer1 Part Number: 232270591001L; Table: Resistors SMD; Part Number: R0402_0R_JUMPER; Component Kind: Standard; Component Type: Standard; Pin Count: 2; Value: 0; Status: Not recommended; Manufacturer Part Number: R0402_0R_JUMPER; Case: 0402; Mounted: Yes; Socket: No; SMD: Yes; Manufacturer1 Example: YAGEO PHYCOMP; Manufacturer1 ComponentHeight: 0.4mm; HelpURL: \\cern.ch\dfs\Applications\Altium\Datasheets\R0402_Phycomp_RC0402.pdf; Author: CERN DEM JLC; CreateDate: 2007-12-03; LatestRevisionDate: 2012-10-17
R222 = R0402_10K_1%_0.0625W_100PPM: as R141 on sheet Clock_management; Part Number: R0402_10K_1%_0.0625W_100PPM; Component Kind: Standard; Component Type: Standard; Pin Count: 2; Value: 10k; Status: Not recommended; Power: 0.0625W; Tolerance: ±1%; Manufacturer Part Number: R0402_10K_1%_0.0625W_100PPM; Case: 0402; Mounted: Yes; Socket: No; SMD: Yes; Manufacturer1 Example: YAGEO PHYCOMP; Manufacturer1 ComponentHeight: 0.4mm; HelpURL: \\cern.ch\dfs\Applications\Altium\Datasheets\R0402_Phycomp_RC0402.pdf; Author: CERN DEM JLC; CreateDate: 2007-12-03; LatestRevisionDate: 2012-10-17